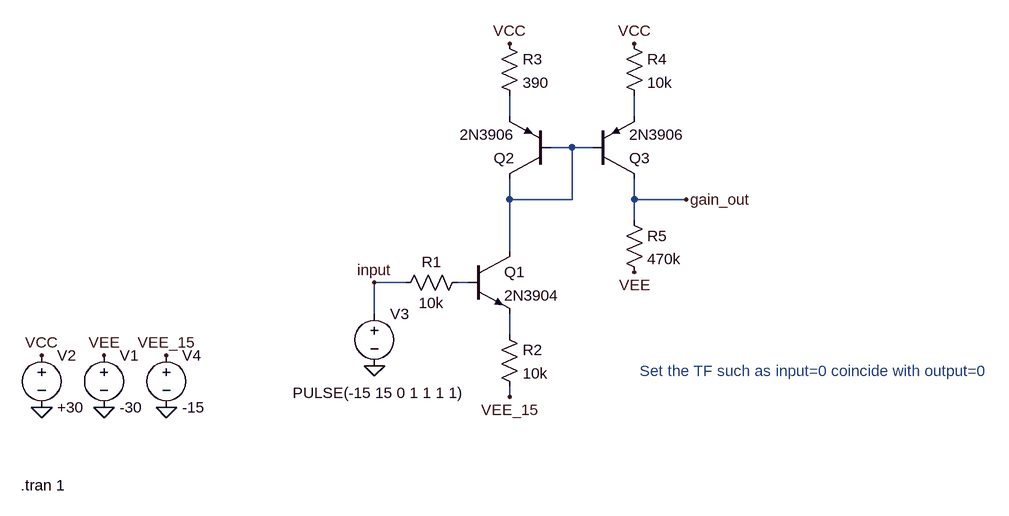
[diagram p0: schematic DCAmplifier.asc]
DCAmplifier.asc, the LTspice schematic file:
Version 4
SHEET 1 944 680
WIRE 176 16 176 -16
WIRE 368 16 368 -16
WIRE 272 64 240 64
WIRE 304 64 272 64
WIRE 176 144 176 112
WIRE 272 144 272 64
WIRE 272 144 176 144
WIRE 368 144 368 112
WIRE 448 144 368 144
WIRE 368 176 368 144
WIRE 176 224 176 144
WIRE 16 272 -32 272
WIRE 112 272 96 272
WIRE -32 320 -32 272
WIRE 176 352 176 320
WIRE 176 448 176 432
FLAG 368 256 VEE
FLAG 176 -96 VCC
FLAG 368 -96 VCC
FLAG 448 144 gain_out
FLAG 176 448 VEE_15
FLAG -544 464 0
FLAG -448 464 0
FLAG -544 384 VCC
FLAG -448 384 VEE
FLAG -32 400 0
FLAG -352 464 0
FLAG -352 384 VEE_15
FLAG -32 272 input
SYMBOL npn 112 224 R0
SYMATTR InstName Q1
SYMATTR Value 2N3904
SYMBOL res 112 256 R90
WINDOW 0 0 56 VBottom 2
WINDOW 3 32 56 VTop 2
SYMATTR InstName R1
SYMATTR Value 10k
SYMBOL res 160 336 R0
SYMATTR InstName R2
SYMATTR Value 10k
SYMBOL pnp 240 112 R180
SYMATTR InstName Q2
SYMATTR Value 2N3906
SYMBOL pnp 304 112 M180
SYMATTR InstName Q3
SYMATTR Value 2N3906
SYMBOL res 160 -112 R0
SYMATTR InstName R3
SYMATTR Value 390
SYMBOL res 352 -112 R0
SYMATTR InstName R4
SYMATTR Value 10k
SYMBOL res 352 160 R0
SYMATTR InstName R5
SYMATTR Value 470k
SYMBOL voltage -448 368 R0
WINDOW 123 0 0 Left 0
WINDOW 39 0 0 Left 0
SYMATTR InstName V1
SYMATTR Value -30
SYMBOL voltage -544 368 R0
WINDOW 123 0 0 Left 0
WINDOW 39 0 0 Left 0
SYMATTR InstName V2
SYMATTR Value +30
SYMBOL voltage -32 304 R0
WINDOW 3 -126 138 Left 2
WINDOW 123 0 0 Left 0
WINDOW 39 0 0 Left 0
SYMATTR InstName V3
SYMATTR Value PULSE(-15 15 0 1 1 1 1)
SYMBOL voltage -352 368 R0
WINDOW 123 0 0 Left 0
WINDOW 39 0 0 Left 0
SYMATTR InstName V4
SYMATTR Value -15
TEXT -576 584 Left 2 !.tran 1
TEXT 376 408 Left 2 ;Set the TF such as input=0 coincide with output=0

The netlist it stands for:
* DCAmplifier.asc
Q1 N003 N004 N005 0 2N3904
R1 N004 input 10k
R2 N005 VEE_15 10k
Q2 N003 N003 N001 0 2N3906
Q3 gain_out N003 N002 0 2N3906
R3 VCC N001 390
R4 VCC N002 10k
R5 gain_out VEE 470k
V1 VEE 0 -30
V2 VCC 0 +30
V3 input 0 PULSE(-15 15 0 1 1 1 1)
V4 VEE_15 0 -15
.model NPN NPN
.model PNP PNP
.lib standard.bjt
.tran 1
* Set the TF such as input=0 coincide with output=0
.backanno
.end

* Results of the author's LTspice run, read from the files saved beside the schematic
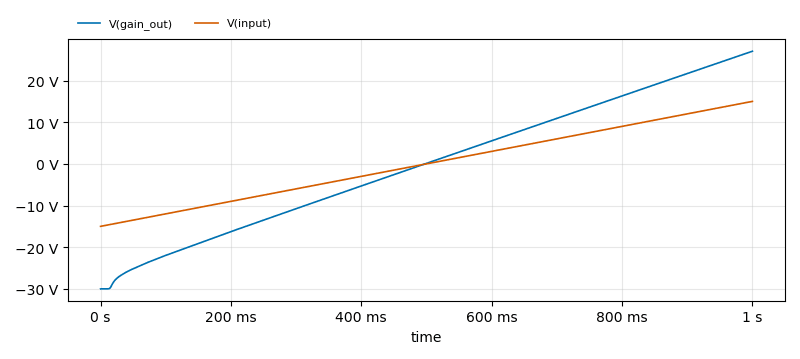
[diagram p1: Transient Analysis of DCAmplifier.asc, plotted from the saved traces]
* Transient Analysis, 1 run:
*   V(gain_out): min -30 V, max 27.04 V, average -89.8 mV, rms 16.05 V, last 27.04 V
*   V(input): min -15 V, max 15 V, average 0 V, rms 8.755 V, last 15 V